# Altium schematic sheet USB-uart.SchDoc: Interface USB-UART
size A4; Author: Anderson, Jorge; CompanyName: LEICI - FI-UNLP; Revision: 1.3; SheetNumber: 4; SheetTotal: 5
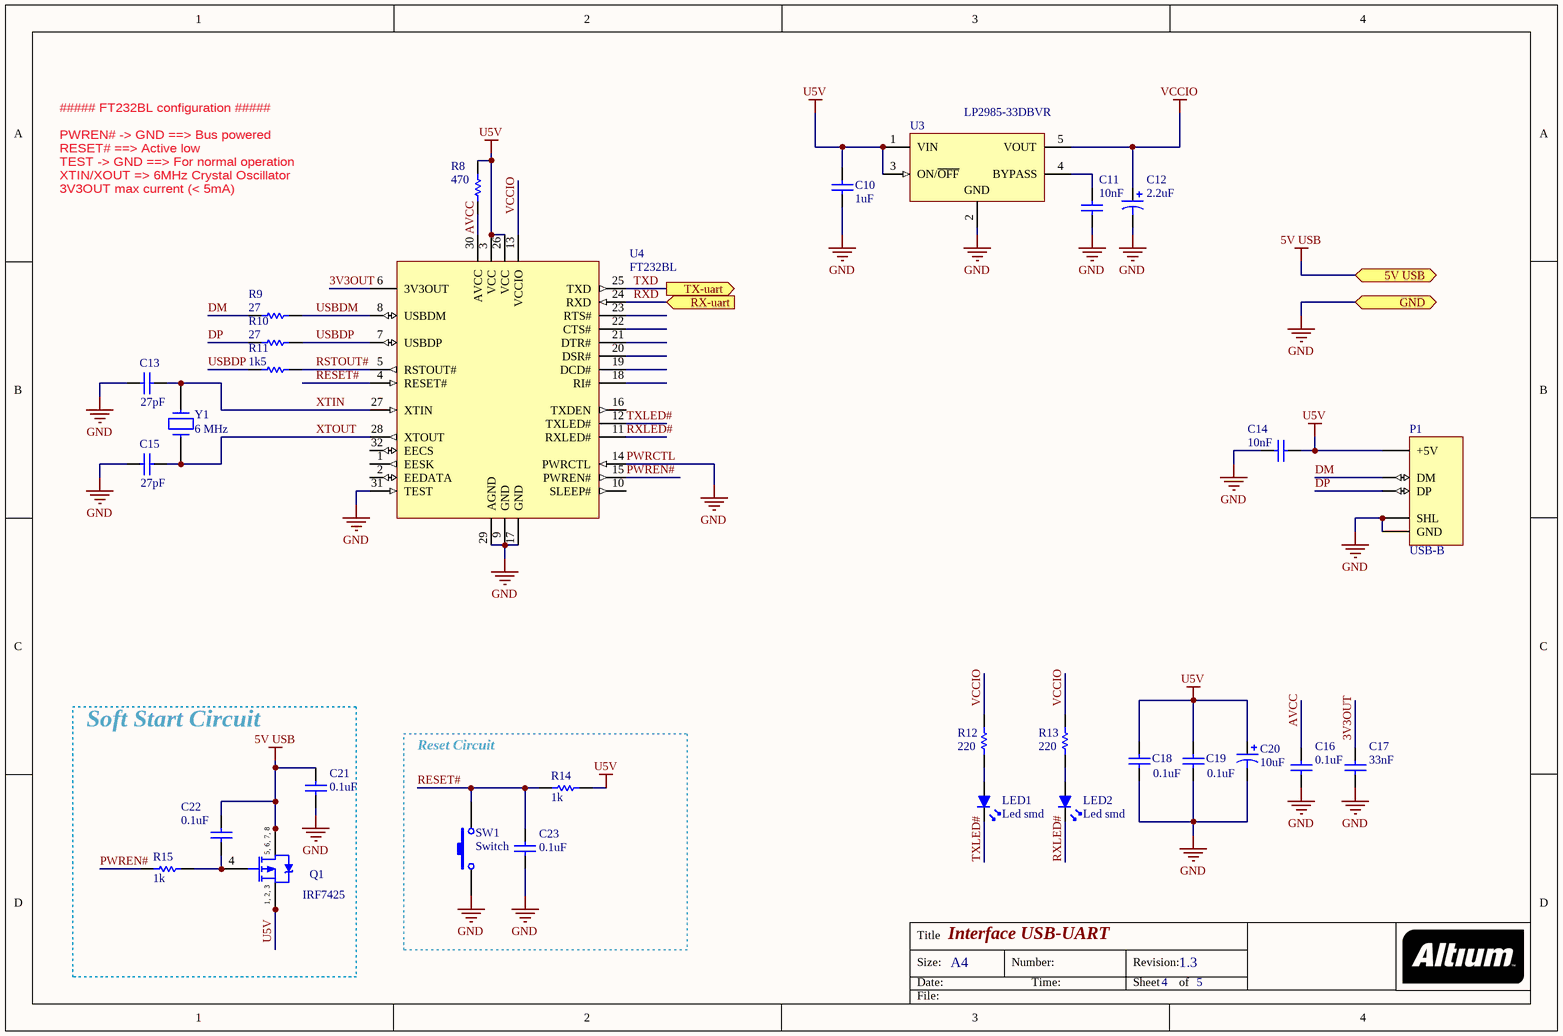
[diagram p0: USB-uart.SchDoc]

## Parts
C10  value 1uF  [0805]  (hidden comment: C1u)
C11  value 10nF  [C 1206]  (hidden comment: C10n)
C12  value 2.2uF  [Tantalum]  (hidden comment: CT2.2u)
C13  value 27pF  [C 1206]  (hidden comment: C27p)
C14  value 10nF  [C 1206]  (hidden comment: C10n)
C15  value 27pF  [C 1206]  (hidden comment: C27p)
C16  value 0.1uF  [C 1206]  (hidden comment: C0.1u)
C17  value 33nF  [C 1206]  (hidden comment: C33n)
C18  value 0.1uF  [C 1206]  (hidden comment: C0.1u)
C19  value 0.1uF  [C 1206]  (hidden comment: C0.1u)
C20  value 10uF  [CAP4x7x1.5mm]  (hidden comment: C10u)
C21  value 0.1uF  [C 1206]  (hidden comment: C0.1u)
C22  value 0.1uF  [C 1206]  (hidden comment: C0.1u)
C23  value 0.1uF  [C 1206]  (hidden comment: C0.1u)
LED1  Led smd  [LED 1206]
LED2  Led smd  [LED 1206]
P1  USB-B  [USBB]
Q1  IRF7425  [SO-8_L]
R8  value 470  [R 1206]  (hidden comment: R470)
R9  value 27  [R 1206]  (hidden comment: R27)
R10  value 27  [R 1206]  (hidden comment: R27)
R11  value 1k5  [R 1206]  (hidden comment: R1k5)
R12  value 220  [R 1206]  (hidden comment: R220)
R13  value 220  [R 1206]  (hidden comment: R220)
R14  value 1k  [R 1206]  (hidden comment: R1k)
R15  value 1k  [R 1206]  (hidden comment: R1k)
SW1  Switch  [TACT SW]
U3  LP2985-33DBVR  [TI-DBV5_N]
U4  FT232BL  [LQFP-32_N]
Y1  value 6 MHz  [Y TRHU]  (hidden comment: Cristal de Cuarzo)

## Blocks framed on the sheet
Soft Start Circuit: C21 C22 Q1 R15
Reset Circuit: C23 R14 SW1

## Ports
5V USB, GND, RX-uart (in), TX-uart (out)

## Nets
5V USB: C21.1 C22.1 Q1.5(D) Q1.6(D) Q1.7(D) Q1.8(D) ; port 5V USB
PWRCTL: C10.2 C11.2 C12.2 C13.2 C14.2 C15.2 C16.1 C17.1 C18.1 C19.1 C20.2 C21.2 C23.2 P1.0(SHL) P1.4(GND) SW1.1 U3.2(GND) U4.9(GND) U4.14(PWRCTL) U4.17(GND) U4.29(AGND) U4.31(TEST) ; port GND  [also labelled GND]
U5V: C10.1 C14.1 C18.2 C19.2 C20.1 P1.1(+5V) Q1.1(S) Q1.2(S) Q1.3(S) R8.1 R14.2 U3.1(VIN) U3.3(ON/~{OFF}) U4.3(VCC) U4.26(VCC)
VCCIO: C12.1 R12.1 R13.1 U3.5(VOUT) U4.13(VCCIO)
3V3OUT: C17.2 U4.6(3V3OUT)
AVCC: C16.2 R8.2 U4.30(AVCC)
DM: P1.2(DM) R9.2
DP: P1.3(DP) R10.2
PWREN#: R15.1 U4.15(PWREN#)
RESET#: C23.1 R14.1 SW1.2 U4.4(RESET#)
RSTOUT#: R11.1 U4.5(RSTOUT#)
RXD: U4.24(RXD) ; port RX-uart
RXLED#: LED2.2(K) U4.11(RXLED#)
TXD: U4.25(TXD) ; port TX-uart
TXLED#: LED1.2(K) U4.12(TXLED#)
USBDM: R9.1 U4.8(USBDM)
USBDP: R10.1 R11.2 U4.7(USBDP)
XTIN: C13.1 U4.27(XTIN) Y1.1
XTOUT: C15.1 U4.28(XTOUT) Y1.2
NetC11_1: C11.1 U3.4(BYPASS)
NetC22_2: C22.2 Q1.4(G) R15.2
NetLED1_1: LED1.1(A) R12.2
NetLED2_1: LED2.1(A) R13.2

Not connected (* = marked no-connect by the designer): U4 1(EESK) 2(EEDATA) 10(SLEEP#) 16(TXDEN) 18(RI#) 19(DCD#) 20(DSR#) 21(DTR#) 22(CTS#) 23(RTS#) 32(EECS)

## Notes on the sheet
- ##### FT232BL configuration #####
  PWREN# -> GND ==> Bus powered
  RESET# ==> Active low
  TEST -> GND ==> For normal operation
  XTIN/XOUT => 6MHz Crystal Oscillator
  3V3OUT max current (< 5mA)
- Title
- Size:
- Date:
- A4
- Number:
- Time:
- Revision:
- Sheet
- of
- File:
- (in symbol IRF7425) 5, 6, 7, 8; 1, 2, 3

## Library data of the parts
C10 C11 C13-C19 C21-C23 = C: Capacitor; .PCBCheck: Used; .Creator: SR; .SCHCheck: Used; Category: Capacitores
C12 = C Tantalum: Tantalum capacitor
C20 = Capacitor pol: Capacitor polarzado
LED1 = LED: LED red; .Creator: SR; .PCBCheck: Used; .SCHCheck: Used
LED2 = LED: LED green; .Creator: SR; .PCBCheck: Used; .SCHCheck: Used
P1 = USB-B: Conector USB tipo B
Q1 = IRF7425: HEXFET Power MOSFET; Published: 17-Sep-2003; LatestRevisionDate: 13-Apr-2006; LatestRevisionNote: IPC-7351 Footprint Added.; DatasheetVersion: 20-Nov-2001; PackageVersion: Feb-2001; PackageReference: SO-8; Publisher: Altium Limited; PackageDescription: 8-Pin Plastic Small Outline Integrated Circuit 1.27 mm Pitch; Code_JEDEC: MS-012-AA; Code_IPC: SOIC127P600-8; ComponentLink1Description: Manufacturer Link; ComponentLink1URL: http://www.irf.com/; ComponentLink2Description: Datasheet; ComponentLink2URL: http://www.irf.com/product-info/datasheets/data/irf7425.pdf
R8-R15 = R: Resistencia; .Creator: SR; .PCBCheck: Used; .SCHCheck: Used; Category: Resistencias
SW1 = Pulsador NA 4 term: .Creator: G; .PCBCheck: G; .SCHCheck: G
U3 = LP2985-10DBVR: Single Output Low Noise LDO, 150 mA, Fixed 3.3 V Output, 2.2 to 16 V Input, with Low IQ, 5-pin SOT-23 (DBV), -40 to 125 degC, Green (RoHS & no Sb/Br); Manufacturer: Texas Instruments; Accuracy(%): 1.5; Fixed Output Options(V): 3.3; Iout(Max)(A): 0.15; Iq(Typ)(mA): 0.85; SubFamily: Single Channel LDO; Vdo(Typ)(mV): 280; Vin(Max)(V): 16; Vin(Min)(V): 2.2; DatasheetVersion: SLVS522N; PackageVersion: 4073253-4/K; PackageReference: DBV5; PackageDescription: 5-Pin Plastic Small Outline, Body 1.60 Ã— 2.90 mm, Pitch 0.95 mm; Eco-Plan: Green (RoHS & no Sb/Br); Vout Adj(Max)(V): 3.3; Vout Adj(Min)(V): 3.3; Mounting Technology: Surface Mount; Code_JEDEC: MO-178; PartNumber: LP2985-33DBVR; ComponentLink1Description: Manufacturer URL; ComponentLink1URL: http://www.ti.com/; ComponentLink2Description: Datasheet; ComponentLink2URL: http://www.ti.com/general/docs/lit/getliterature.tsp?genericPartNumber=LP2985-10&fileType=pdf; ComponentLink3Description: Package Specification; ComponentLink3URL: http://www.ti.com/litv/pdf/mpds018i; Supplier 1: Farnell; Supplier Part Number 1: 2412118; Supplier 2: Digi-Key; Supplier Part Number 2: 296-18476-6-ND
U4 = FT232BL: USB UART Asynchronous Serial Data Transfer Chip, LQFP-32, Pb-Free; Published: 6-Oct-2005; LatestRevisionDate: 13-Apr-2006; LatestRevisionNote: IPC-7351 Footprint Added.; DatasheetVersion: ver 1.8, Dec-2005; PackageVersion: 2004; PackageReference: LQFP-32; Publisher: Altium Limited; PackageDescription: 32-Pin Thin Quad Flat Pack 0.8 mm Pitch; ComponentLink1Description: Manufacturer Link; ComponentLink1URL: http://www.ftdichip.com/Products/ICs/FT232B.htm; ComponentLink2Description: Datasheet; ComponentLink2URL: http://www.ftdichip.com/Support/Documents/DataSheets/ICs/DS_FT232BL.pdf
Y1 = Cristal de Cuarzo: Cristal de 6Mhz; .Creator: G; .PCBCheck: Used; .SCHCheck: Used